# EAGLE schematic BLDC Motor Driver (EAGLE 7.3.0)
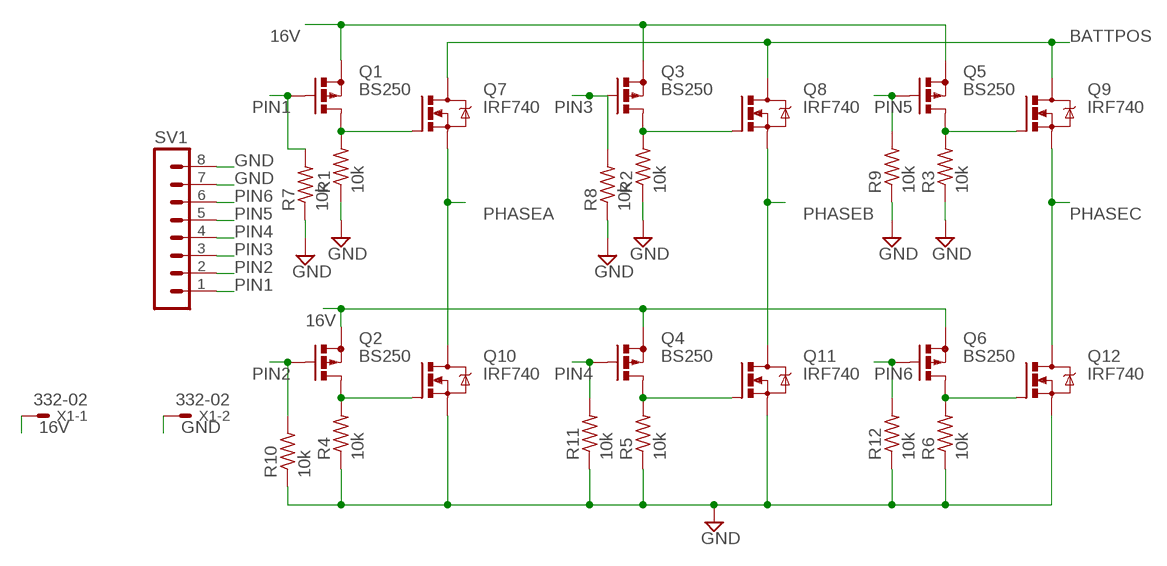
[diagram p0: schematic, sheet 1]

## Parts
Q1  BS250  [SOT54E]
Q2  BS250  [SOT54E]
Q3  BS250  [SOT54E]
Q4  BS250  [SOT54E]
Q5  BS250  [SOT54E]
Q6  BS250  [SOT54E]
Q7  IRF740  [TO220BV]
Q8  IRF740  [TO220BV]
Q9  IRF740  [TO220BV]
Q10  IRF740  [TO220BV]
Q11  IRF740  [TO220BV]
Q12  IRF740  [TO220BV]
R1  10k  R-US_R0805  [R0805]
R2  10k  R-US_R0805  [R0805]
R3  10k  R-US_R0805  [R0805]
R4  10k  R-US_R0805  [R0805]
R5  10k  R-US_R0805  [R0805]
R6  10k  R-US_R0805  [R0805]
R7  10k  R-US_R0805  [R0805]
R8  10k  R-US_R0805  [R0805]
R9  10k  R-US_R0805  [R0805]
R10  10k  R-US_R0805  [R0805]
R11  10k  R-US_R0805  [R0805]
R12  10k  R-US_R0805  [R0805]
SV1  MA08-1  [MA08-1]
X1  332-02  [332-02]

## Nets
16V: Q1.S Q2.S Q3.S Q4.S Q5.S Q6.S X1.1
BATTPOS: Q7.D Q8.D Q9.D
GND: Q10.S Q11.S Q12.S R1.1 R2.1 R3.1 R4.1 R5.1 R6.1 R7.1 R8.1 R9.1 R10.1 R11.1 R12.1 SV1.7 SV1.8 X1.2
N$1: Q1.D Q7.G R1.2
N$2: Q3.D Q8.G R2.2
N$3: Q5.D Q9.G R3.2
N$4: Q2.D Q10.G R4.2
N$5: Q4.D Q11.G R5.2
N$6: Q6.D Q12.G R6.2
PHASEA: Q7.S Q10.D
PHASEB: Q8.S Q11.D
PHASEC: Q9.S Q12.D
PIN1: Q1.G R7.2 SV1.1
PIN2: Q2.G R10.2 SV1.2
PIN3: Q3.G R8.2 SV1.3
PIN4: Q4.G R11.2 SV1.4
PIN5: Q5.G R9.2 SV1.5
PIN6: Q6.G R12.2 SV1.6

## Library data of the parts
Q1-Q6 = transistor-small-signal:BS250: P-CHANNEL MOS FET
Q7-Q12 = transistor-power:IRF740: N-CHANNEL MOS FET
R1-R12 = resistor:R-US_: RESISTOR, American symbol
SV1 = con-lstb:MA08-1: PIN HEADER; OC_FARNELL: unknown; OC_NEWARK: unknown
X1 = con-garry:332-02: 2 Pin - 2mm Dual Row Source: www.mpe-connector.de / garry_shortform_2012.pdf

## Net classes
0 default: width 0.508 mm, drill 1.016 mm, clearance 0.508 mm